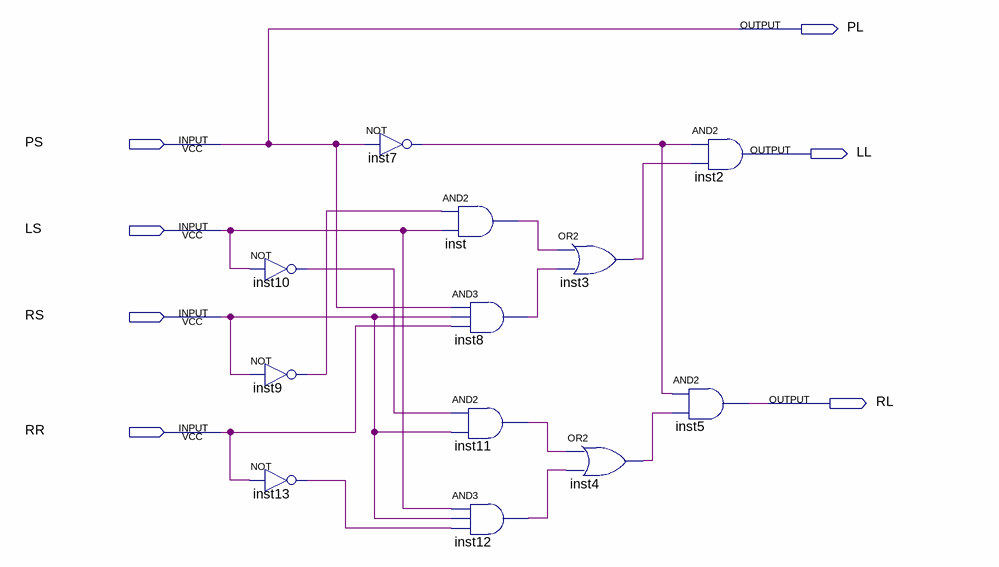
[diagram p0: schematic sheet]
// Quartus schematic Block3.bdf as structural Verilog: 12 symbols, 7 pins
module Block3 (
  input  PS,
  input  LS,
  input  RS,
  input  RR,
  output PL,
  output LL,
  output RL
);

  wire inst3_out, inst4_out, inst7_out, inst8_out, inst9_out, inst10_out, inst11_out, inst12_out, inst13_out,
       inst_out;

  not inst10 (inst10_out, LS);
  not inst9 (inst9_out, RS);
  not inst13 (inst13_out, RR);
  not inst7 (inst7_out, PS);
  and inst (inst_out, inst9_out, LS);
  and inst8 (inst8_out, PS, RS, RR);
  and inst11 (inst11_out, inst10_out, RS);
  and inst12 (inst12_out, LS, RS, inst13_out);
  or inst3 (inst3_out, inst_out, inst8_out);
  or inst4 (inst4_out, inst11_out, inst12_out);
  and inst5 (RL, inst7_out, inst4_out);
  and inst2 (LL, inst7_out, inst3_out);

  assign PL = PS;
endmodule
